# Altium schematic sheet FET Driver.SchDoc
size A4; Organization: Altium Limited; Address1: L3, 12a Rodborough Rd; Address2: Frenchs Forest; Address3: NSW; Address4: Australia 2086; SheetNumber: 6; SheetTotal: 6
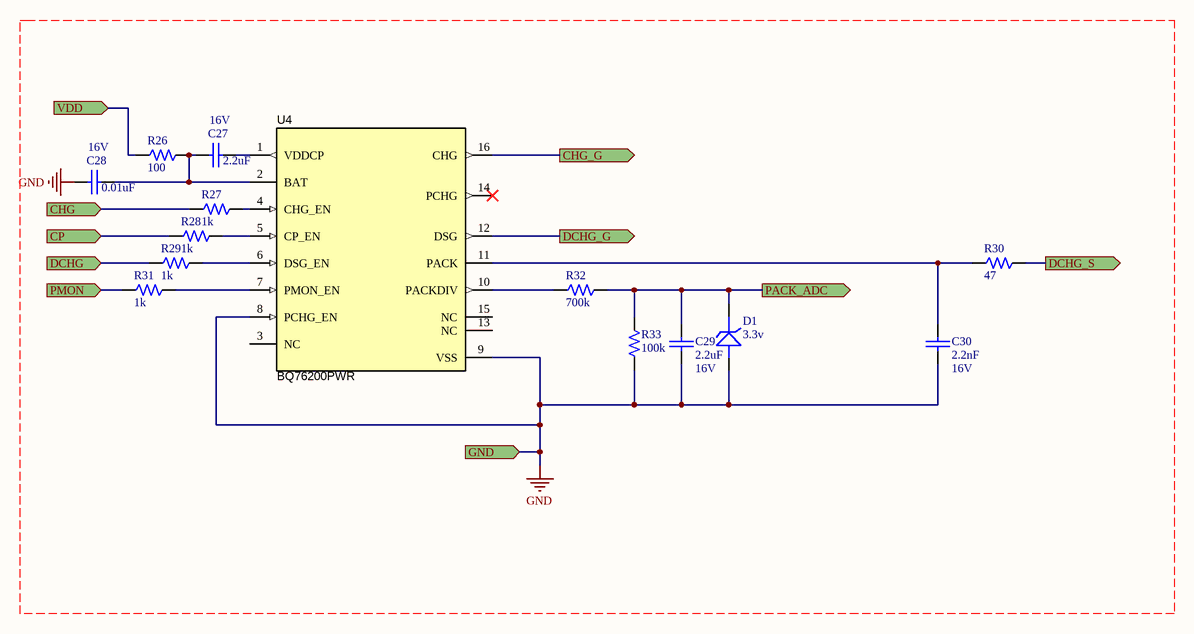
[diagram p0: FET Driver.SchDoc]

## Parts
C27  value 2.2uF  Voltage: 16V  [CAPC0603-RW]  (hidden comment: T542021037308)
C28  value 0.01uF  Voltage: 16V  [CAPC0603-RW]  (hidden comment: T542021037308)
C29  value 2.2uF  Voltage: 16V  [CAPC0603-RW]  (hidden comment: T542021037308)
C30  value 2.2nF  Voltage: 16V  [CAPC0603-RW]  (hidden comment: T542021037308)
D1  MFG Part: 3.3v  [1206-RW]  (hidden comment: T573004282016)
R26  value 100  [0603-RW]  (hidden comment: T502976002399)
R27  value 1k  [0603-RW]  (hidden comment: T502976002399)
R28  value 1k  [0603-RW]  (hidden comment: T502976002399)
R29  value 1k  [0603-RW]  (hidden comment: T502976002399)
R30  value 47  [0603-RW]  (hidden comment: T502976002399)
R31  value 1k  [0603-RW]  (hidden comment: T502976002399)
R32  value 700k  [0603-RW]  (hidden comment: T502976002399)
R33  value 100k  [0603-RW]  (hidden comment: T502976002399)
U4  BQ76200PWR  [TSSOP16]

## Ports
CHG (in), CHG_G (out), CP (in), DCHG (in), DCHG_G (out), DCHG_S (out), GND (in), PACK_ADC (out), PMON (in), VDD (in)

## Nets
GND: C28.1 C29.1 C30.1 D1.1(A) R33.1 U4.8(PCHG_EN) U4.9(VSS) ; port GND
CHG: R27.1 ; port CHG
CHG_G: U4.16(CHG) ; port CHG_G
CP: R28.1 ; port CP
DCHG: R29.1 ; port DCHG
DCHG_G: U4.12(DSG) ; port DCHG_G
DCHG_S: R30.2 ; port DCHG_S
PACK_ADC: C29.2 D1.2(K) R32.2 R33.2 ; port PACK_ADC
PMON: R31.1 ; port PMON
VDD: R26.1 ; port VDD
NetC27_1: C27.1 C28.2 R26.2 U4.2(BAT)
NetC27_2: C27.2 U4.1(VDDCP)
NetC30_2: C30.2 R30.1 U4.11(PACK)
NetR27_2: R27.2 U4.4(CHG_EN)
NetR28_2: R28.2 U4.5(CP_EN)
NetR29_2: R29.2 U4.6(DSG_EN)
NetR31_2: R31.2 U4.7(PMON_EN)
NetR32_1: R32.1 U4.10(PACKDIV)

Not connected (* = marked no-connect by the designer): U4 3(NC) 13(NC) 14(PCHG)* 15(NC)

## Notes on the sheet
- Author
- Title
- Size:
- Date:
- A4
- Number:
- Time:
- Revision:
- Sheet
- of
- Radio Flyer inc
- West Chicago
- File:

## Library data of the parts
C27-C30 = CAP0603 0.01uF 16V 10%_X7R_WALSIN: CAP X7R .01UF 16V +-10% 0603 WALSIN L; Tolerance: 10%; Type: Capacitor; CREATE_NAME: Nathan; DIP&SMD: SMD; SAP: T542021037308; PACKAGE: CAPC0603; Vendor Name: *; MFG: WALSIN; MFG Part: *; Other: X7R; CREATE_TIME: 13-July-2016; Customer Specific: N/A
D1 = ZMM55-C16: ZD 16V 500MW 5% LL34 PAN J K; MFG: PAN JIT; Current: 5MA; Type: ZENER; CREATE_NAME: Nathan; DIP&SMD: SMD; SAP: T573004282016; Vendor Code: *; Vendor Name: *; Tolerance: *; Power: 500MW; VOLTAGE: 16V; CREATE_TIME: 29-Sep-2017; Customer Specific: N/A
R26-R33 = RES0603 1/10W +-1% 976 OHM 100PPM: CHIP 976 OHM 100PPM +-1% 0603 WALS L; Power: 0.1W; MFG: WALSIN; CREATE_NAME: Tom; DIP&SMD: SMD; Vendor Code: *; SAP: T502976002399; Vendor Name: *; MFG Part: *; Type: Resistor; CREATE_TIME: 17-Dec-2015; PACKAGE: 0603; TOL: +-1%; Customer Specific: N/A
U4 = BQ76200: High-Side N-Channel FET Driver, PW0016A (TSSOP-16); Manufacturer: Texas Instruments; SizeAreaWB_mm2: 58.8; SizeArea_mm2: 32.0; SizeZ_mm: 1.2; SizeY_mm: 5.0; U/M: EA; CompType: IC; SizeX_mm: 6.4; ComponentLink1Description: Datasheet Link; RoHS: Y; PackageReference: PW0016A; PartNumber: BQ76200PWR; Publisher: Texas Instruments; PackageDescription: TSSOP-16; Alternate Manufacturer: Texas Instruments; ComponentLink1URL: http://www.ti.com/lit/ds/symlink/bq76200.pdf; LatestRevisionDate: 2017-06-09; Alternate PartNumber: BQ76200PW; MountType: SMT